# Altium schematic sheet Sheet1.SchDoc
size A4
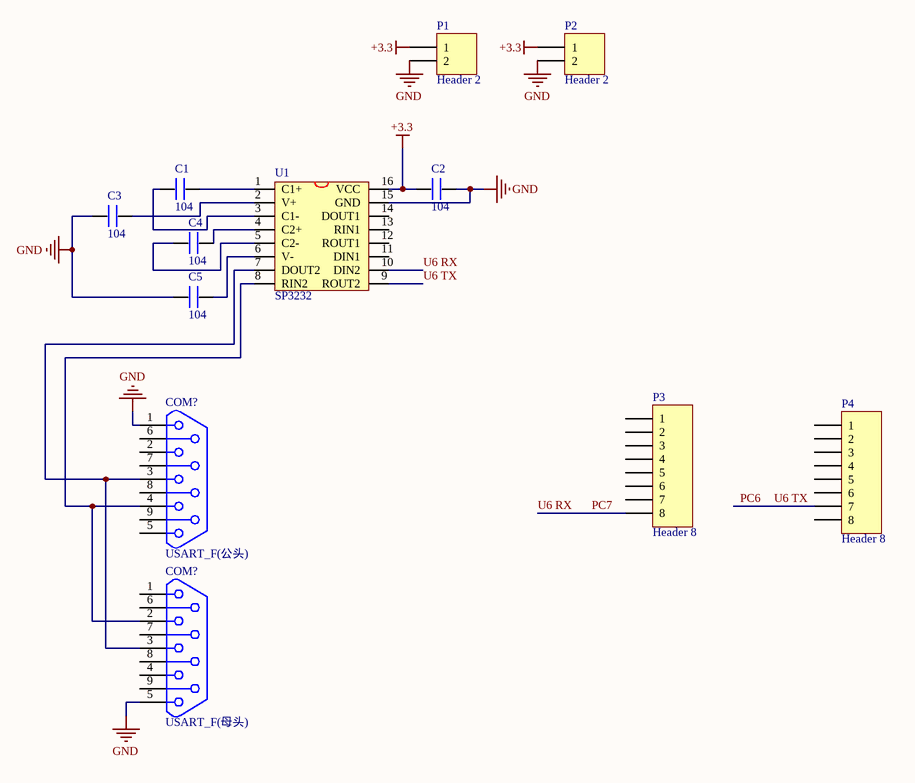
[diagram p0: Sheet1.SchDoc]

## Parts
(Parts that share a designator on the sheet are numbered #1, #2 ... from top to bottom, then left to right.)
C1  104  [0805]
C2  104  [0805]
C3  104  [0805]
C4  104  [0805]
C5  104  [0805]
COM?#1  USART_F(公头)  [DB9/P_A]
COM?#2  USART_F(母头)  [DB9/S_A]
P1  Header 2  [KF128-5.08-2P]
P2  Header 2  [HDR1X2]
P3  Header 8  [HDR2.54-M-LI-8P]
P4  Header 8  [HDR2.54-M-LI-8P]
U1  SP3232  [SOP16M]

## Nets
+3.3: C2.1 P1.1 P2.1 U1.16(VCC)
GND: C2.2 C3.1 C5.2 COM?#1.1 COM?#2.5 P1.2 P2.2 U1.15(GND)
PC6: P4.7 U1.9(ROUT2)  [also labelled U6 TX]
PC7: P3.8 U1.10(DIN2)  [also labelled U6 RX]
NetC1_1: C1.1 U1.3(C1-)
NetC1_2: C1.2 U1.1(C1+)
NetC3_2: C3.2 U1.2(V+)
NetC4_1: C4.1 U1.5(C2-)
NetC4_2: C4.2 U1.4(C2+)
NetC5_1: C5.1 U1.6(V-)
NetCOM?#1_3: COM?#1.3 COM?#2.3 U1.7(DOUT2)
NetCOM?#1_4: COM?#1.4 COM?#2.2 U1.8(RIN2)

Not connected (* = marked no-connect by the designer): COM?#1 2 5 6 7 8 9; COM?#2 1 4 6 7 8 9; P3 1 2 3 4 5 6 7; P4 1 2 3 4 5 6 8; U1 11(DIN1) 12(ROUT1) 13(RIN1) 14(DOUT1)

## Library data of the parts
C1-C5 = C
COM?#1 COM?#2 = DB9
P1 P2 = Header 2: Header, 2-Pin; LatestRevisionDate: 17-Jul-2002; LatestRevisionNote: Re-released for DXP Platform.; Publisher: Altium Limited
P3 P4 = Header 8: Header, 8-Pin; LatestRevisionDate: 17-Jul-2002; LatestRevisionNote: Re-released for DXP Platform.; Publisher: Altium Limited
U1 = MAX3232